# Altium project EMC_2017.PrjPCB
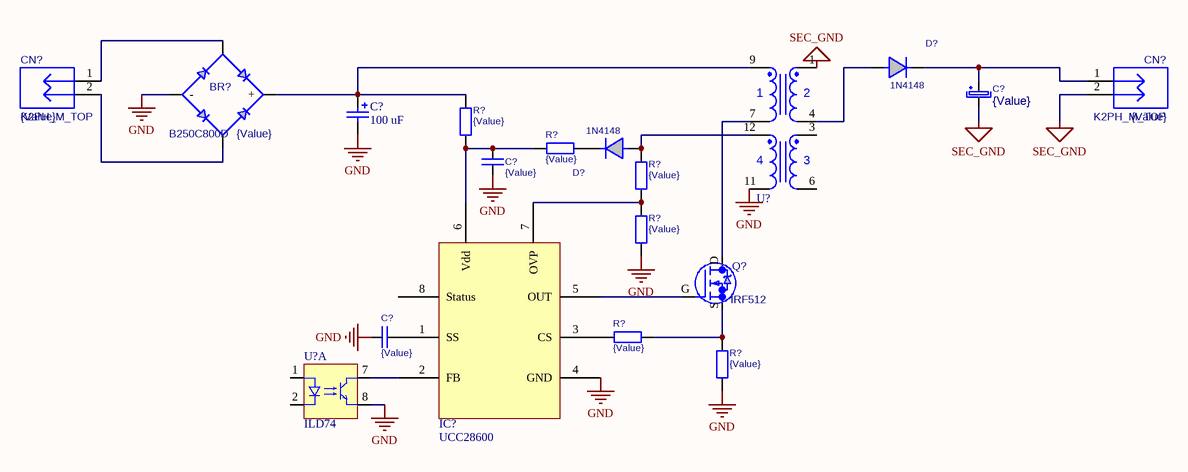
[diagram p0: EMC delavnica.SchDoc]
1 sheet, 19 parts. Net scope: global (net labels, ports and power ports of the same name join across sheets).

## Sheet EMC delavnica.SchDoc
size A4

### Parts
(Parts that share a designator on the sheet are numbered #1, #2 ... from top to bottom, then left to right.)
BR?  B250C800D  value {Value}  [DIP4M-GREZ]
C?#1  100 uF  [WCAP-ATG8_18x31.5x7.5x0.8]
C?#2  {Value}  [C-SMD-ELKO-D]
C?#3  {Value}  [C0805]
C?#4  {Value}  [C0805]
CN?#1  K2PH_M_TOP  value {Value}  [K2PH_M_TOP]
CN?#2  K2PH_M_TOP  value {Value}  [K2PH_M_TOP]
D?#1  1N4148  [MELF3517N_DIO]
D?#2  1N4148  [MELF3517N_DIO]
IC?  UCC28600  [SOIC127P600X175-8M]
Q?  IRF512  [TO-220AB vertical]
R?#1  {Value}  [R0805]
R?#2  {Value}  [R0805]
R?#3  {Value}  [R0805]
R?#4  {Value}  [R0805]
R?#5  {Value}  [R0805]
R?#6  {Value}  [R0805]
U?#1  760871113  [WE-UOST_EE16/8/5]  (value not drawn)
U?#2  ILD74  [DIP8]  (part A of 2)

### Nets
GND: BR?.GND(-) C?#1.2 C?#3.2 C?#4.1 IC?.4(GND) R?#4.2 R?#6.2 U?#1.11 U?#2.8(E)
SEC_GND: C?#2.2 CN?#2.2 U?#1.1
NetBR?_AC1: BR?.AC1 CN?#1.1
NetBR?_AC2: BR?.AC2 CN?#1.2
NetBR?_PLUS: BR?.PLUS(+) C?#1.1 R?#1.1 U?#1.9
NetC?#2_1: C?#2.1 CN?#2.1 D?#1.K
NetC?#3_1: C?#3.1 IC?.6(Vdd) R?#1.2 R?#2.1
NetC?#4_2: C?#4.2 IC?.1(SS)
NetD?#1_A: D?#1.A U?#1.4
NetD?#2_A: D?#2.A R?#3.1 U?#1.12
NetD?#2_K: D?#2.K R?#2.2
NetIC?_2: IC?.2(FB) U?#2.7(C)
NetIC?_3: IC?.3(CS) R?#5.1
NetIC?_5: IC?.5(OUT) Q?.G
NetIC?_7: IC?.7(OVP) R?#3.2 R?#4.1
NetQ?_D: Q?.D U?#1.7
NetQ?_S: Q?.S R?#5.2 R?#6.1

Not connected (* = marked no-connect by the designer): IC? 8(Status); U?#1 3 6; U?#2 1(A) 2(K)

### Notes on the sheet
- (in symbol 760871113) 2

### Library data of the parts
C?#1 = WCAP-ATG8, 860011381012: WCAP-ATG8 Aluminum Electrolytic Capacitors, 100 uF; RatedVoltage: 400V; PublishedDate: July 2016; Publisher: Wurth Elektronik; ComponentLink1Description: Manufacturer; ComponentLink1URL: http://www.we-online.de; ComponentLink2Description: Datasheet; ComponentLink2URL: http://katalog.we-online.de/pbs/datasheet/860011381012.pdf; PartNumber: 860011381012; Value: 100 uF; Size: 18mmx31.5mm
C?#2 = C+: Capacitor Polarized; Value: {Value}
C?#3 C?#4 = C: Capacitor; Value: {Value}
D?#1 D?#2 = 1N4148: pin to pad: A>2 K>1; Value: *
IC? = UCC28600: Flyback power supply controller from TI
Q? = IRF512: Value: {Value}
R?#1-R?#6 = R: Value: {Value}
U?#1 = 760871113: WE-UOST Universal Offline Standard Transformers, size EE16/8/5, 1310 uH , 140:6:6:16 , 12.5 W; Inductance: 1310 uH; OutputPower: 12.5 W; PublishedDate: Nov. 2016; Publisher: Wurth Elektronik; ComponentLink1Description: Manufacturer; ComponentLink1URL: http://www.we-online.de; ComponentLink2Description: Datasheet; ComponentLink2URL: http://katalog.we-online.de/pbs/datasheet/760871113.pdf; PartNumber: 760871113; Size: EE16/8/5; TurnsRatio: 140:6:6:16
U?#2 = ILD74: Optocoupler, Phototransistor Output, Dual Channel, TTL Compatible, Pb-free; Note: Coupling Capacitance, 0.5 pF; Note: Transfer Ratio, 35 % Typical; Published: 6-Oct-2005; DatasheetDocument: Rev. 1.4, Oct-2004; PackageDocument: Dec-2003; PackageReference: DIP8; Publisher: Altium Limited; ComponentLink1Description: Manufacturer Link; ComponentLink1URL: http://www.vishay.com/optocouplers/list/product-83640/; ComponentLink2Description: Datasheet; ComponentLink2URL: http://www.vishay.com/docs/83640/83640.pdf